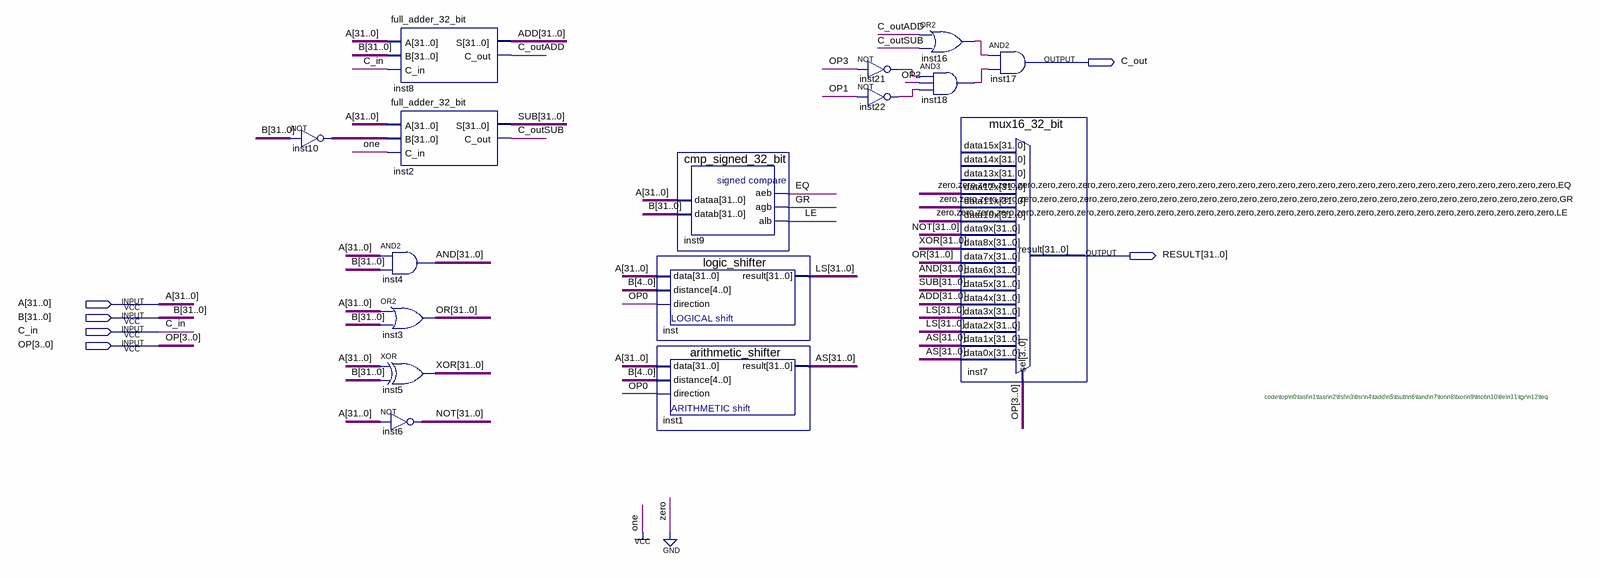
[diagram p0: schematic sheet]
// Quartus schematic alu.bdf as structural Verilog: 16 symbols, 6 pins
module alu (
  input  [31:0] A,
  input  [31:0] B,
  input  C_in,
  input  [3:0] OP,
  output C_out,
  output [31:0] RESULT
);

  wire C_outADD, C_outSUB, EQ, GR, inst16_out, inst18_out, inst21_out, inst22_out, LE;
  wire [31:0] ADD, AND, AS, inst10_out, LS, NOT, OR, SUB, XOR;

  assign inst10_out = ~B;  // NOT inst10, 32 bits wide
  full_adder_32_bit inst8 (.A(A), .B(B), .C_in(C_in), .S(ADD), .C_out(C_outADD));
  full_adder_32_bit inst2 (.A(A), .B(inst10_out), .C_in(1'b1), .S(SUB), .C_out(C_outSUB));
  assign AND = A & B;  // AND2 inst4, 32 bits wide
  assign OR = A | B;  // OR2 inst3, 32 bits wide
  assign XOR = A ^ B;  // XOR inst5, 32 bits wide
  assign NOT = ~A;  // NOT inst6, 32 bits wide
  cmp_signed_32_bit inst9 (.dataa(A), .datab(B), .aeb(EQ), .agb(GR), .alb(LE));
  logic_shifter inst (.data(A), .distance(B[4:0]), .direction(OP[0]), .result(LS));
  arithmetic_shifter inst1 (.data(A), .distance(B[4:0]), .direction(OP[0]), .result(AS));
  not inst21 (inst21_out, OP[3]);
  not inst22 (inst22_out, OP[1]);
  or inst16 (inst16_out, C_outADD, C_outSUB);
  and inst18 (inst18_out, inst21_out, OP[2], inst22_out);
  mux16_32_bit inst7 (
    .data12x({{31{1'b0}}, EQ}), .data11x({{31{1'b0}}, GR}), .data10x({{31{1'b0}}, LE}), .data9x(NOT),
    .data8x(XOR), .data7x(OR), .data6x(AND), .data5x(SUB), .data4x(ADD), .data3x(LS), .data2x(LS),
    .data1x(AS), .data0x(AS), .sel(OP), .result(RESULT));  // open: data15x, data14x, data13x
  and inst17 (C_out, inst16_out, inst18_out);

  // Notes on the sheet:
  //   code\top\n0\tasl\n1\tasr\n2\tlsl\n3\tlsr\n4\tadd\n5\tsub\n6\tand\n7\tor\n8\txor\n9\tnot\n10\tle\n11\tgr\n12\teq
endmodule
